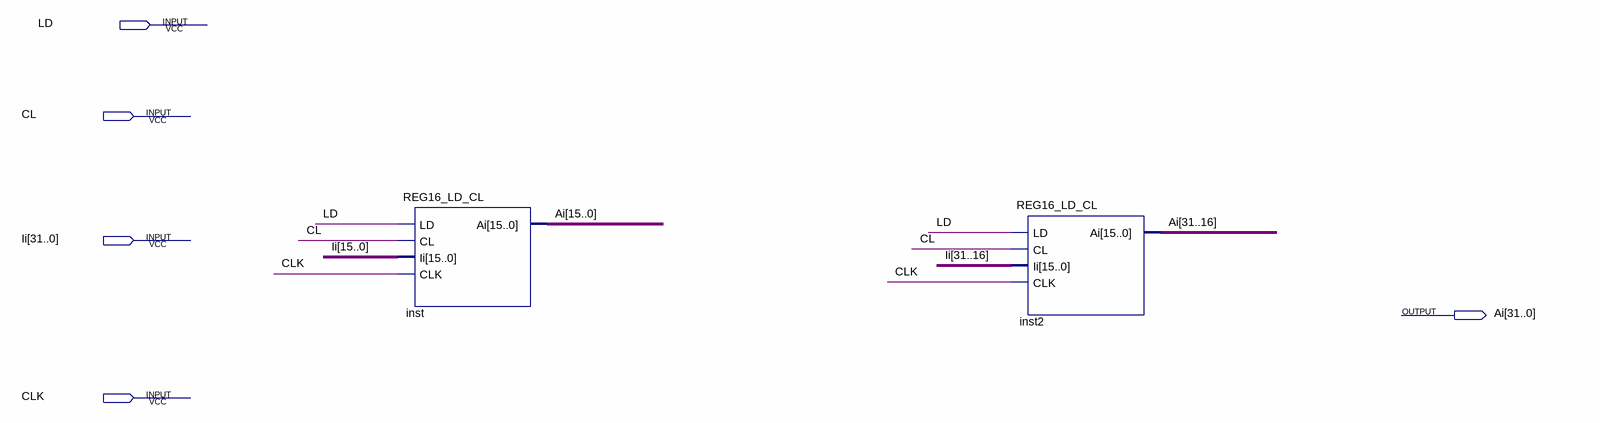
[diagram p0: schematic sheet]
// Quartus schematic REG32_LD_CL.bdf as structural Verilog: 2 symbols, 5 pins
module REG32_LD_CL (
  input  LD,
  input  CL,
  input  [31:0] Ii,
  input  CLK,
  output [31:0] Ai
);

  REG16_LD_CL inst (.LD(LD), .CL(CL), .Ii(Ii[15:0]), .CLK(CLK), .Ai(Ai[15:0]));
  REG16_LD_CL inst2 (.LD(LD), .CL(CL), .Ii(Ii[31:16]), .CLK(CLK), .Ai(Ai[31:16]));
endmodule
